# Altium schematic sheet Lattice_FPGA.SchDoc
size 431 x 279 mm; SheetNumber: 2; SheetTotal: 7; ENG_APP_DATE: --/--/--; DSN_APP_DATE: --/--/--; CHK_APP_DATE: --/--/--
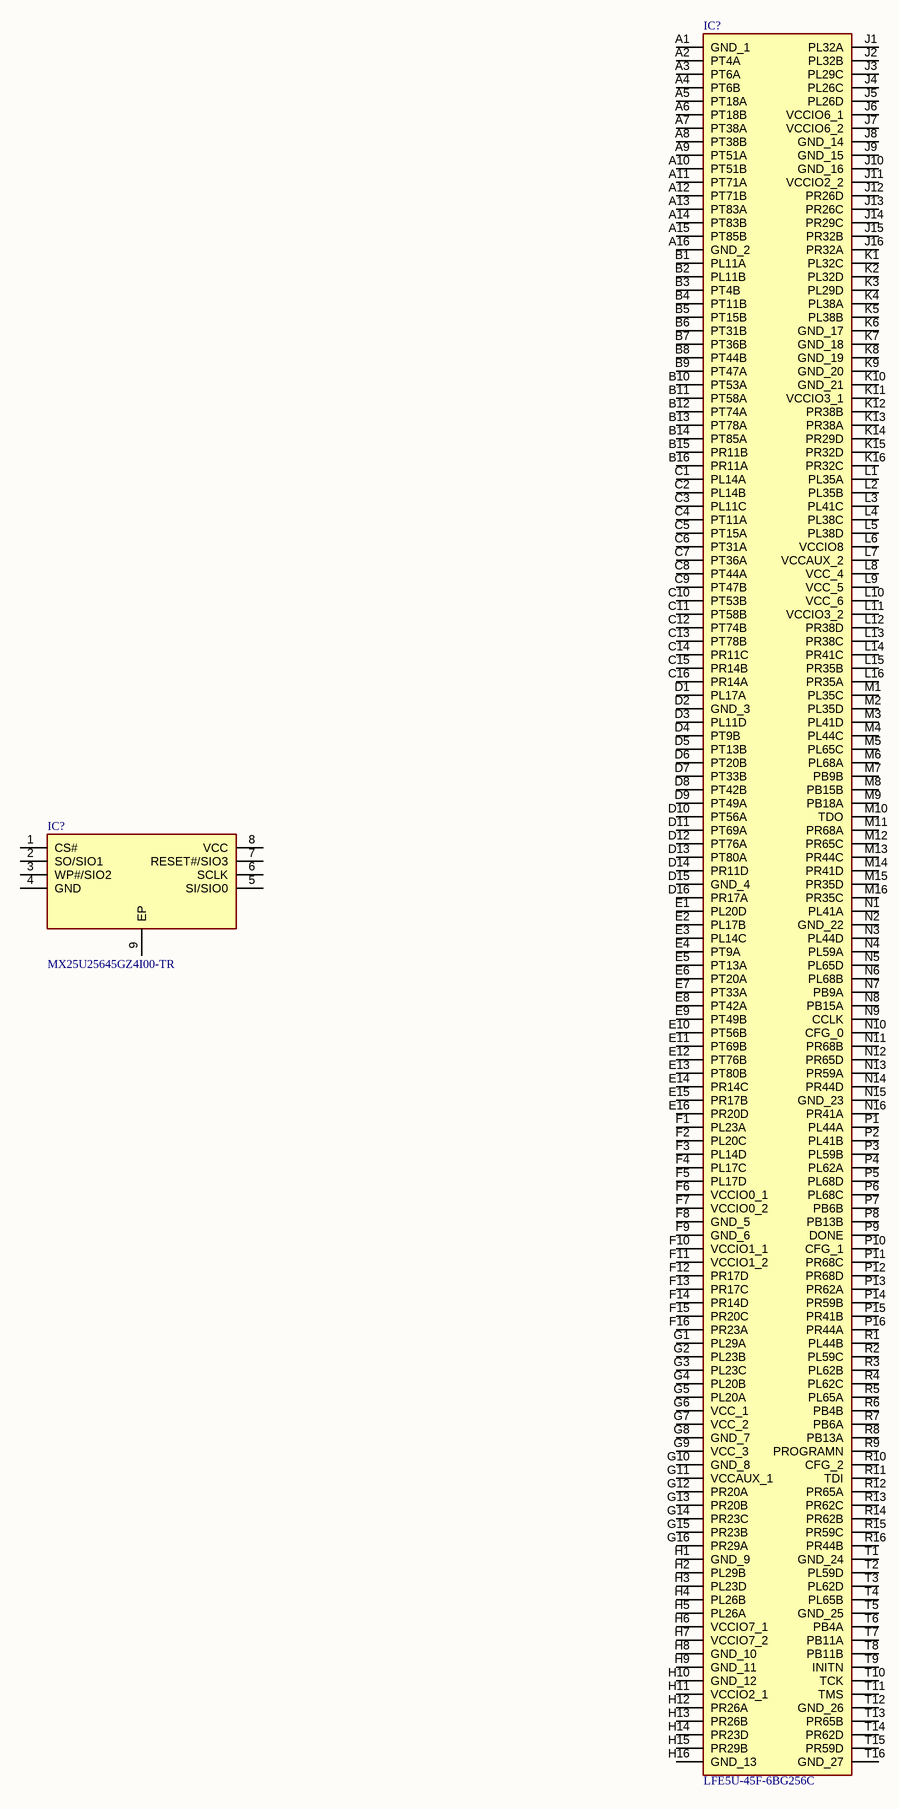
[diagram p0: Lattice_FPGA.SchDoc]

## Parts
(Parts that share a designator on the sheet are numbered #1, #2 ... from top to bottom, then left to right.)
IC?#1  LFE5U-45F-6BG256C  [BGA256C80P16X16_1400X1400X170]
IC?#2  MX25U25645GZ4I00-TR  [SON127P800X600X80-9N-D]

## Nets

Not connected (* = marked no-connect by the designer): IC?#1 A1(GND_1) A2(PT4A) A3(PT6A) A4(PT6B) A5(PT18A) A6(PT18B) A7(PT38A) A8(PT38B) A9(PT51A) A10(PT51B) A11(PT71A) A12(PT71B) A13(PT83A) A14(PT83B) A15(PT85B) A16(GND_2) B1(PL11A) B2(PL11B) B3(PT4B) B4(PT11B) B5(PT15B) B6(PT31B) B7(PT36B) B8(PT44B) B9(PT47A) B10(PT53A) B11(PT58A) B12(PT74A) B13(PT78A) B14(PT85A) B15(PR11B) B16(PR11A) C1(PL14A) C2(PL14B) C3(PL11C) C4(PT11A) C5(PT15A) C6(PT31A) C7(PT36A) C8(PT44A) C9(PT47B) C10(PT53B) C11(PT58B) C12(PT74B) C13(PT78B) C14(PR11C) C15(PR14B) C16(PR14A) D1(PL17A) D2(GND_3) D3(PL11D) D4(PT9B) D5(PT13B) D6(PT20B) D7(PT33B) D8(PT42B) D9(PT49A) D10(PT56A) D11(PT69A) D12(PT76A) D13(PT80A) D14(PR11D) D15(GND_4) D16(PR17A) E1(PL20D) E2(PL17B) E3(PL14C) E4(PT9A) E5(PT13A) E6(PT20A) E7(PT33A) E8(PT42A) E9(PT49B) E10(PT56B) E11(PT69B) E12(PT76B) E13(PT80B) E14(PR14C) E15(PR17B) E16(PR20D) F1(PL23A) F2(PL20C) F3(PL14D) F4(PL17C) F5(PL17D) F6(VCCIO0_1) F7(VCCIO0_2) F8(GND_5) F9(GND_6) F10(VCCIO1_1) F11(VCCIO1_2) F12(PR17D) F13(PR17C) F14(PR14D) F15(PR20C) F16(PR23A) G1(PL29A) G2(PL23B) G3(PL23C) G4(PL20B) G5(PL20A) G6(VCC_1) G7(VCC_2) G8(GND_7) G9(VCC_3) G10(GND_8) G11(VCCAUX_1) G12(PR20A) G13(PR20B) G14(PR23C) G15(PR23B) G16(PR29A) H1(GND_9) H2(PL29B) H3(PL23D) H4(PL26B) H5(PL26A) H6(VCCIO7_1) H7(VCCIO7_2) H8(GND_10) H9(GND_11) H10(GND_12) H11(VCCIO2_1) H12(PR26A) H13(PR26B) H14(PR23D) H15(PR29B) H16(GND_13) J1(PL32A) J2(PL32B) J3(PL29C) J4(PL26C) J5(PL26D) J6(VCCIO6_1) J7(VCCIO6_2) J8(GND_14) J9(GND_15) J10(GND_16) J11(VCCIO2_2) J12(PR26D) J13(PR26C) J14(PR29C) J15(PR32B) J16(PR32A) K1(PL32C) K2(PL32D) K3(PL29D) K4(PL38A) K5(PL38B) K6(GND_17) K7(GND_18) K8(GND_19) K9(GND_20) K10(GND_21) K11(VCCIO3_1) K12(PR38B) K13(PR38A) K14(PR29D) K15(PR32D) K16(PR32C) L1(PL35A) L2(PL35B) L3(PL41C) L4(PL38C) L5(PL38D) L6(VCCIO8) L7(VCCAUX_2) L8(VCC_4) L9(VCC_5) L10(VCC_6) L11(VCCIO3_2) L12(PR38D) L13(PR38C) L14(PR41C) L15(PR35B) L16(PR35A) M1(PL35C) M2(PL35D) M3(PL41D) M4(PL44C) M5(PL65C) M6(PL68A) M7(PB9B) M8(PB15B) M9(PB18A) M10(TDO) M11(PR68A) M12(PR65C) M13(PR44C) M14(PR41D) M15(PR35D) M16(PR35C) N1(PL41A) N2(GND_22) N3(PL44D) N4(PL59A) N5(PL65D) N6(PL68B) N7(PB9A) N8(PB15A) N9(CCLK) N10(CFG_0) N11(PR68B) N12(PR65D) N13(PR59A) N14(PR44D) N15(GND_23) N16(PR41A) P1(PL44A) P2(PL41B) P3(PL59B) P4(PL62A) P5(PL68D) P6(PL68C) P7(PB6B) P8(PB13B) P9(DONE) P10(CFG_1) P11(PR68C) P12(PR68D) P13(PR62A) P14(PR59B) P15(PR41B) P16(PR44A) R1(PL44B) R2(PL59C) R3(PL62B) R4(PL62C) R5(PL65A) R6(PB4B) R7(PB6A) R8(PB13A) R9(PROGRAMN) R10(CFG_2) R11(TDI) R12(PR65A) R13(PR62C) R14(PR62B) R15(PR59C) R16(PR44B) T1(GND_24) T2(PL59D) T3(PL62D) T4(PL65B) T5(GND_25) T6(PB4A) T7(PB11A) T8(PB11B) T9(INITN) T10(TCK) T11(TMS) T12(GND_26) T13(PR65B) T14(PR62D) T15(PR59D) T16(GND_27); IC?#2 1(CS#) 2(SO/SIO1) 3(WP#/SIO2) 4(GND) 5(SI/SIO0) 6(SCLK) 7(RESET#/SIO3) 8(VCC) 9(EP)

## Notes on the sheet
- DWG. NO.
- REV.
- SHT.
- THIS DOCUMENT AND THE DATA DISCLOSED HEREIN OR HEREWITH IS THE PROPERTY OF ALTIUM LIMITED AND MAY BE FREELY DISTRIBUTED IN WHOLE. NO RIGHTS ARE RESERVED OR EXPRESS OR IMPLIED WARANTEE GIVEN.
- REVISION
- DESCRIPTION
- DATE
- APPROVED
- ENG:
- APPROVALS
- PROJECT
- DSN:
- CHK:
- REFERENCE DOCUMENTS
- PROJECT REVISION:
- TITLE
- DOCUMENT REVISION:
- DESIGN ITEM:
- BOM:
- FAB DWG:
- PCB DWG:
- ASSY DWG:
- SCALE:
- SIZE
- B
- CAGE CODE
- FILE NAME
- DWG NO.
- SHEET
- OF
- REV

## Library data of the parts
IC?#1 = LFE5U-45F-6BG256C: Integrated Circuit; Manufacturer_Name: Lattice Semiconductor; Datasheet Link: https://www.latticesemi.com/-/media/LatticeSemi/Documents/DataSheets/ECP5/FPGA-DS-02012-2-8-ECP5-ECP5G-Family-Data-Sheet.ashx?document_id=50461; Height: 1.7mm; Manufacturer_Part_Number: LFE5U-45F-6BG256C; Mouser Part Number: 842-LFE5U45F6BG256C; Mouser Price/Stock: https://www.mouser.co.uk/ProductDetail/Lattice/LFE5U-45F-6BG256C?qs=w%2Fv1CP2dgqpblS%252B2xYE99A%3D%3D; Arrow Part Number: LFE5U-45F-6BG256C; Arrow Price/Stock: https://www.arrow.com/en/products/lfe5u-45f-6bg256c/lattice-semiconductor?utm_currency=USD&region=nac
IC?#2 = MX25U25645GZ4I00-TR: Integrated Circuit; Manufacturer_Name: Macronix; Datasheet Link: https://www.mouser.de/datasheet/2/819/MX25U25645G_2c_1_8V_2c_256Mb_2c_v1_4-3371111.pdf; Height: 0.8mm; Manufacturer_Part_Number: MX25U25645GZ4I00-TR